# Altium project Bluetooth_Speaker_Driver.PrjPcb (part 2 of 2)
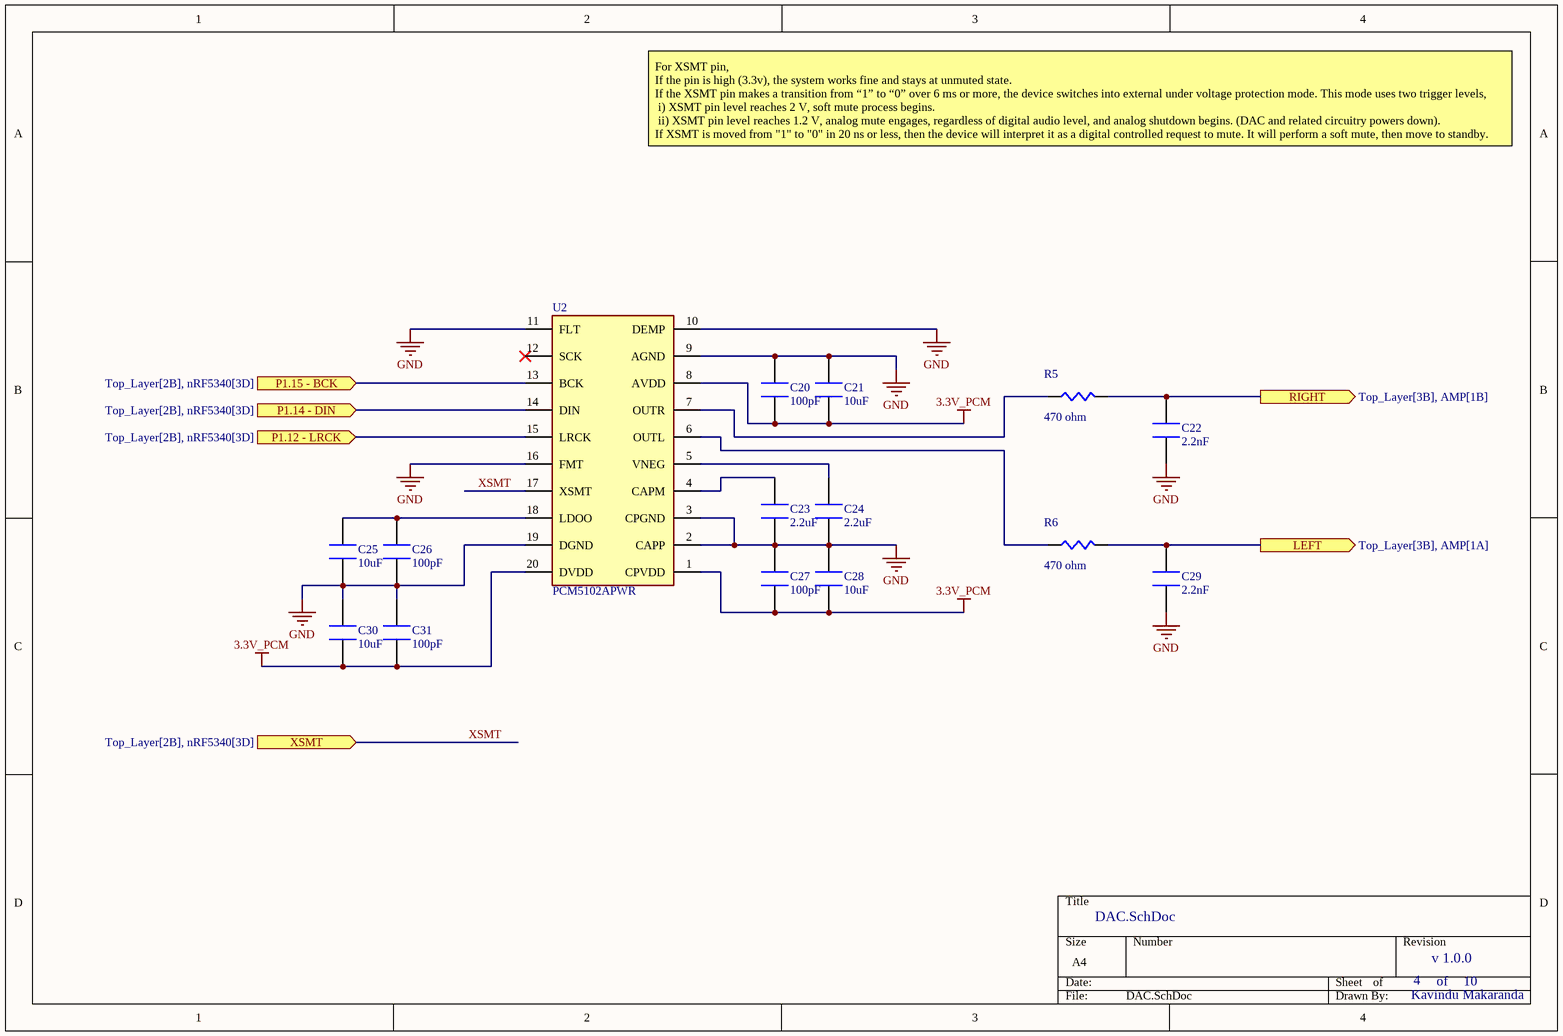
[diagram p10: DAC.SchDoc]

## Nets that join several sheets
3.3V_nRF: nRF5340 (30 pins), U_nRF5340/U_LED_Indicator_? (LED1D.2), U_nRF5340/U_LED_Indicator_? (LED1C.2), U_nRF5340/U_LED_Indicator_? (LED1B.2), U_nRF5340/U_LED_Indicator_? (LED1A.2), Power_Section (C58.2 U7.5)
3.3V_PCM: Power_Section (C64.2 U8.5), DAC (9 pins)
12V: Power_Section (5 pins), Stereo_L&R_TPA3138D2 (FB3.1), Mono_Bass_TPA3138D2 (FB7.1)
+5V_RC4580: 5v negative and positive channels (C44.1 C45.1 R14.1 U4.1), AMP (U10.8), 4th_Order_Linwitz-Riley_Low_Pass_Filter (U9.8)
-5V_RC4580: 5v negative and positive channels (C46.1 C47.1 R15.1 U5.1), AMP (U10.4), 4th_Order_Linwitz-Riley_Low_Pass_Filter (U9.4)
GND: nRF5340 (50 pins), U_nRF5340/U_LED_Indicator_? (Q1D.2 R4D.2), U_nRF5340/U_LED_Indicator_? (Q1C.2 R4C.2), U_nRF5340/U_LED_Indicator_? (Q1B.2 R4B.2), U_nRF5340/U_LED_Indicator_? (Q1A.2 R4A.2), Power_Section (18 pins), 5v negative and positive channels (28 pins), AMP (5 pins), Stereo_L&R_TPA3138D2 (26 pins), Mono_Bass_TPA3138D2 (20 pins), 4th_Order_Linwitz-Riley_Low_Pass_Filter (5 pins), DAC (19 pins)
5v_TPS54202: Power_Section (12 pins), 5v negative and positive channels (6 pins)
NetC22_2: AMP (C72.1 C73.1), DAC (C22.2 R5.2)
NetC29_2: AMP (C70.1 C71.1), DAC (C29.2 R6.2)
NetC67_2: Mono_Bass_TPA3138D2 (C112.1), 4th_Order_Linwitz-Riley_Low_Pass_Filter (C67.2 R25.2)
NetC70_2: AMP (C70.2 R28.2), Stereo_L&R_TPA3138D2 (C89.1)
NetC73_2: AMP (C73.2 R31.2), Stereo_L&R_TPA3138D2 (C95.1)
NetR21_1: AMP (R32.1 U10.1), 4th_Order_Linwitz-Riley_Low_Pass_Filter (R21.1)
P0.00 / XL1: nRF5340 (U1.N1), DAC (U2.15)
P0.01 / XL2: nRF5340 (U1.R1), DAC (U2.13)
P0.04 / AIN0: nRF5340 (U1.V2), Stereo_L&R_TPA3138D2 (R39.2 U11.2)
P0.05 / AIN1: nRF5340 (U1.Y2), Mono_Bass_TPA3138D2 (R44.2 U12.2)
P0.24: nRF5340 (U1.AL27), U_nRF5340/U_LED_Indicator_? (R3D.1)
P0.25 / AIN4: nRF5340 (U1.AK28), U_nRF5340/U_LED_Indicator_? (R3B.1)
P0.26 / AIN5: nRF5340 (U1.AL29), U_nRF5340/U_LED_Indicator_? (R3C.1)
P0.27 / AIN6: nRF5340 (U1.AK30), U_nRF5340/U_LED_Indicator_? (R3A.1)
P1.00: nRF5340 (U1.M2), DAC (U2.17)
P1.01: nRF5340 (U1.P2), DAC (U2.14)

## Assembly variants
Fabrication Variant: not fitted C? L?